# Altium schematic sheet Block_Diagram.SchDoc
size A4; CompanyName: Zohm Control GmbH; Address1: Rittersbacher Straße 48c; Address2: 91126 Schwabach; Address3: GERMANY; DocumentNumber: 2; SheetNumber: 2; SheetTotal: 6; Website: www.zohm-control.com
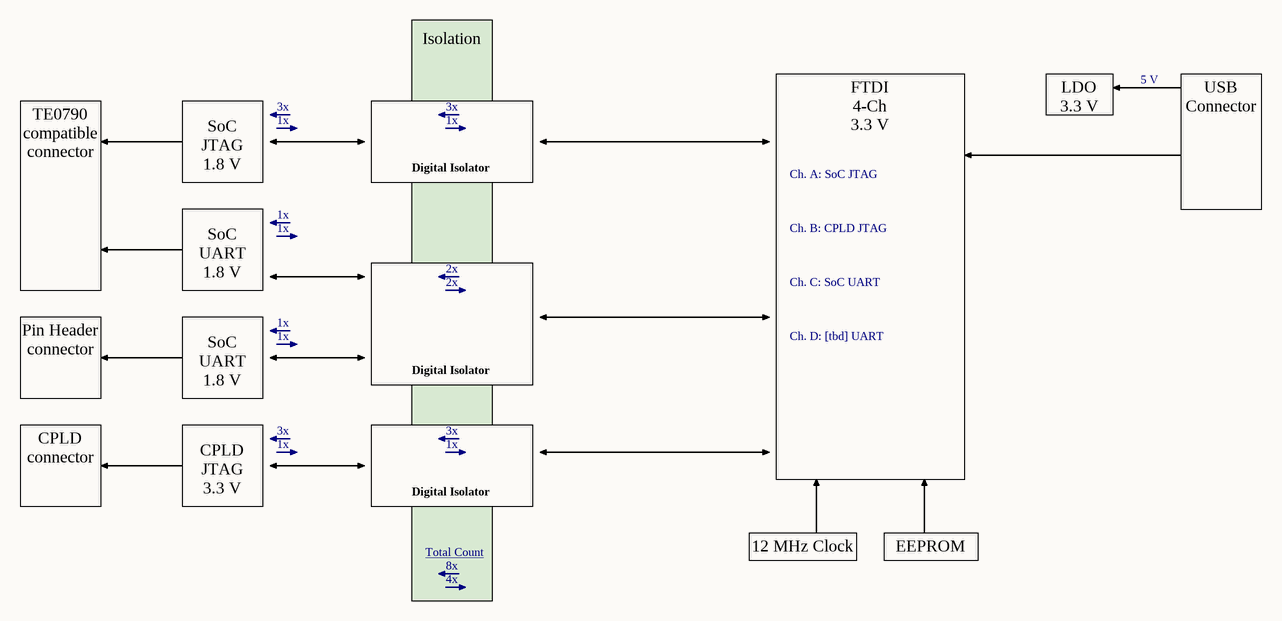
[diagram p0: Block_Diagram.SchDoc]

## Notes on the sheet
- 5 V
- 3x
- 1x
- LDO
  3.3 V
- SoC
  JTAG
  1.8 V
- Digital Isolator
- Ch. A: SoC JTAG
- Ch. B: CPLD JTAG
- USB
  Connector
- TE0790
  compatible
  connector
- SoC
  UART
  1.8 V
- 2x
- Ch. C: SoC UART
- Ch. D: [tbd] UART
- Pin Header
  connector
- CPLD
  connector
- CPLD
  JTAG
  3.3 V
- FTDI
  4-Ch
  3.3 V
- Total Count
- 8x
- 12 MHz Clock
- EEPROM
- Isolation
- 4x
- Title:
- Project:
- Date:
- Revision:
- Variant:
- Design Engineer:
- Sheet
- of